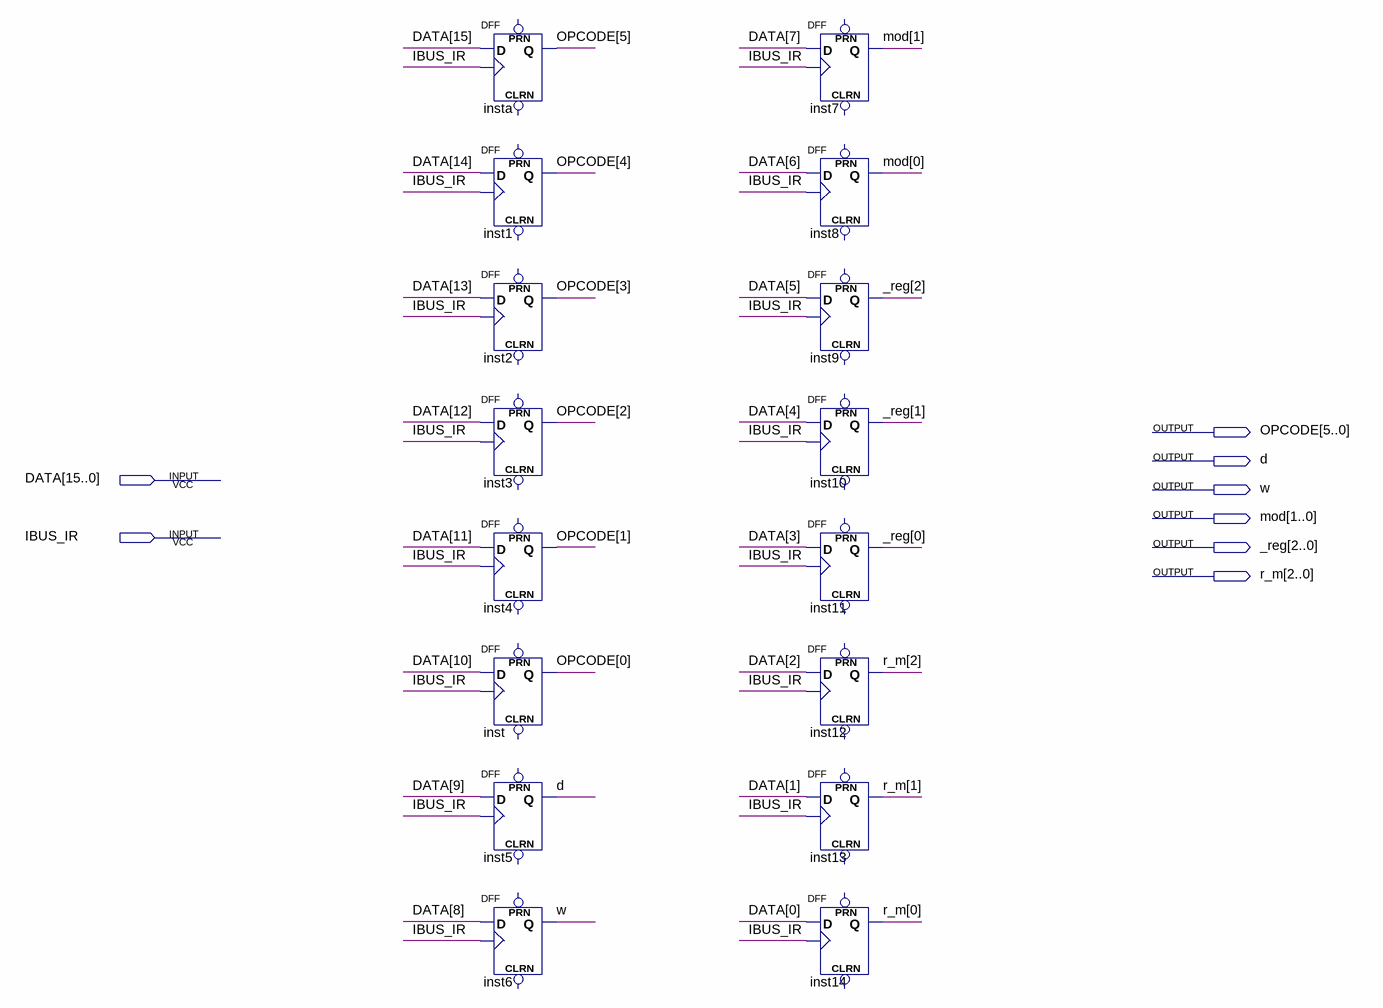
[diagram p0: schematic sheet]
// Quartus schematic IR.bdf as structural Verilog: 16 symbols, 8 pins
module IR (
  input  [15:0] DATA,
  input  IBUS_IR,
  output [5:0] OPCODE,
  output d,
  output w,
  output [1:0] mod,
  output [2:0] _reg,
  output [2:0] r_m
);

  DFF insta (.CLK(IBUS_IR), .D(DATA[15]), .Q(OPCODE[5]));  // open: CLRN, PRN
  DFF inst1 (.CLK(IBUS_IR), .D(DATA[14]), .Q(OPCODE[4]));  // open: CLRN, PRN
  DFF inst2 (.CLK(IBUS_IR), .D(DATA[13]), .Q(OPCODE[3]));  // open: CLRN, PRN
  DFF inst3 (.CLK(IBUS_IR), .D(DATA[12]), .Q(OPCODE[2]));  // open: CLRN, PRN
  DFF inst4 (.CLK(IBUS_IR), .D(DATA[11]), .Q(OPCODE[1]));  // open: CLRN, PRN
  DFF inst (.CLK(IBUS_IR), .D(DATA[10]), .Q(OPCODE[0]));  // open: CLRN, PRN
  DFF inst5 (.CLK(IBUS_IR), .D(DATA[9]), .Q(d));  // open: CLRN, PRN
  DFF inst6 (.CLK(IBUS_IR), .D(DATA[8]), .Q(w));  // open: CLRN, PRN
  DFF inst7 (.CLK(IBUS_IR), .D(DATA[7]), .Q(mod[1]));  // open: CLRN, PRN
  DFF inst8 (.CLK(IBUS_IR), .D(DATA[6]), .Q(mod[0]));  // open: CLRN, PRN
  DFF inst9 (.CLK(IBUS_IR), .D(DATA[5]), .Q(_reg[2]));  // open: CLRN, PRN
  DFF inst10 (.CLK(IBUS_IR), .D(DATA[4]), .Q(_reg[1]));  // open: CLRN, PRN
  DFF inst11 (.CLK(IBUS_IR), .D(DATA[3]), .Q(_reg[0]));  // open: CLRN, PRN
  DFF inst12 (.CLK(IBUS_IR), .D(DATA[2]), .Q(r_m[2]));  // open: CLRN, PRN
  DFF inst13 (.CLK(IBUS_IR), .D(DATA[1]), .Q(r_m[1]));  // open: CLRN, PRN
  DFF inst14 (.CLK(IBUS_IR), .D(DATA[0]), .Q(r_m[0]));  // open: CLRN, PRN
endmodule
